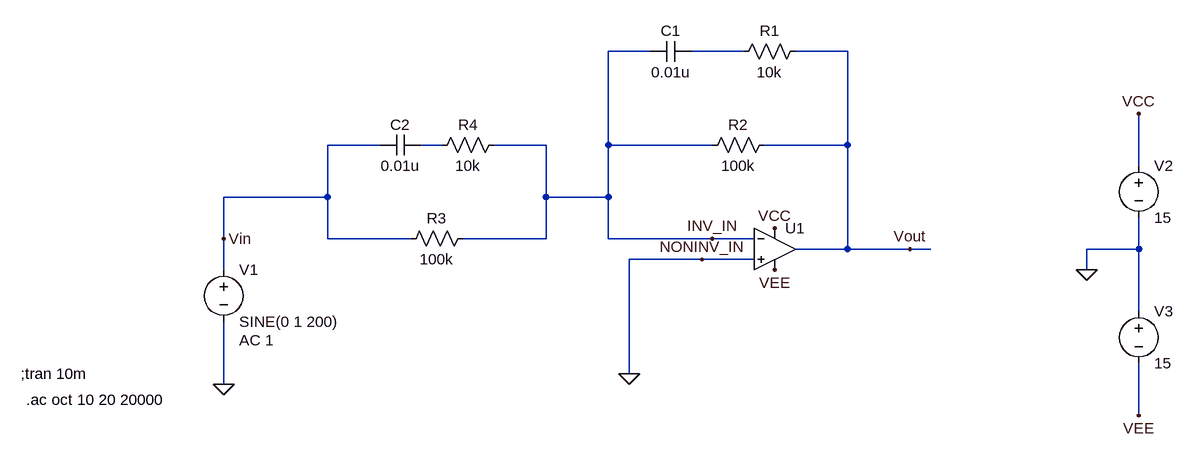
[diagram p0: schematic PreDeEmphasis.asc]
PreDeEmphasis.asc, the LTspice schematic file:
Version 4
SHEET 1 880 680
WIRE -304 -192 -368 -192
WIRE -160 -192 -240 -192
WIRE 0 -192 -80 -192
WIRE -720 -48 -800 -48
WIRE -624 -48 -656 -48
WIRE -464 -48 -544 -48
WIRE -368 -48 -368 -192
WIRE -208 -48 -368 -48
WIRE 0 -48 0 -192
WIRE 0 -48 -128 -48
WIRE 448 -16 448 -96
WIRE -800 32 -800 -48
WIRE -800 32 -960 32
WIRE -464 32 -464 -48
WIRE -368 32 -368 -48
WIRE -368 32 -464 32
WIRE -960 96 -960 32
WIRE -800 96 -800 32
WIRE -672 96 -800 96
WIRE -464 96 -464 32
WIRE -464 96 -592 96
WIRE -368 96 -368 32
WIRE -208 96 -368 96
WIRE -144 96 -208 96
WIRE 0 112 0 -48
WIRE 0 112 -80 112
WIRE 96 112 0 112
WIRE 128 112 96 112
WIRE 448 112 448 64
WIRE 448 112 368 112
WIRE -224 128 -336 128
WIRE -144 128 -224 128
WIRE -960 144 -960 96
WIRE 368 144 368 112
WIRE 448 208 448 112
WIRE -336 304 -336 128
WIRE -960 320 -960 224
WIRE 448 368 448 288
FLAG -960 320 0
FLAG 368 144 0
FLAG 448 -96 VCC
FLAG 448 368 VEE
FLAG -112 144 VEE
FLAG -112 80 VCC
FLAG -208 96 INV_IN
FLAG -224 128 NONINV_IN
FLAG -336 304 0
FLAG -960 96 Vin
FLAG 96 112 Vout
SYMBOL voltage -960 128 R0
WINDOW 123 24 124 Left 2
WINDOW 39 0 0 Left 2
SYMATTR Value2 AC 1
SYMATTR InstName V1
SYMATTR Value SINE(0 1 200)
SYMBOL voltage 448 -32 R0
WINDOW 123 0 0 Left 2
WINDOW 39 0 0 Left 2
SYMATTR InstName V2
SYMATTR Value 15
SYMBOL voltage 448 192 R0
WINDOW 123 0 0 Left 2
WINDOW 39 0 0 Left 2
SYMATTR InstName V3
SYMATTR Value 15
SYMBOL Opamps\\UniversalOpamp2 -112 112 R0
SYMATTR InstName U1
SYMBOL res -112 -64 R90
WINDOW 0 0 56 VBottom 2
WINDOW 3 32 56 VTop 2
SYMATTR InstName R2
SYMATTR Value 100k
SYMBOL res -576 80 R90
WINDOW 0 0 56 VBottom 2
WINDOW 3 32 56 VTop 2
SYMATTR InstName R3
SYMATTR Value 100k
SYMBOL cap -240 -208 R90
WINDOW 0 0 32 VBottom 2
WINDOW 3 32 32 VTop 2
SYMATTR InstName C1
SYMATTR Value 0.01u
SYMBOL res -64 -208 R90
WINDOW 0 0 56 VBottom 2
WINDOW 3 32 56 VTop 2
SYMATTR InstName R1
SYMATTR Value 10k
SYMBOL cap -656 -64 R90
WINDOW 0 0 32 VBottom 2
WINDOW 3 32 32 VTop 2
SYMATTR InstName C2
SYMATTR Value 0.01u
SYMBOL res -528 -64 R90
WINDOW 0 0 56 VBottom 2
WINDOW 3 32 56 VTop 2
SYMATTR InstName R4
SYMATTR Value 10k
TEXT -1264 344 Left 2 !.ac oct 10 20 20000
TEXT -1272 304 Left 2 !;tran 10m

The netlist it stands for:
* PreDeEmphasis.asc
V1 Vin 0 SINE(0 1 200) AC 1
V2 VCC 0 15
V3 0 VEE 15
XU1 0 INV_IN VCC VEE Vout level.2 Avol=1Meg GBW=10Meg Slew=10Meg ilimit=25m rail=0 Vos=0 phimargin=45 en=0 enk=0 in=0 ink=0 Rin=500Meg  ; pins IN+ IN- V+ V- OUT
R2 Vout INV_IN 100k
R3 INV_IN Vin 100k
C1 N001 INV_IN 0.01u
R1 Vout N001 10k
C2 N002 Vin 0.01u
R4 INV_IN N002 10k
.ac oct 10 20 20000
;tran 10m
.lib UniversalOpamps2.sub
.backanno
.end